# Altium schematic sheet ALLPRINT-CAPBOARD-677512-INDEX-INPUTS.SchDoc
size A3; Organization: Altium Limited; Address1: 3 Minna Close; Address2: Belrose; Address3: NSW 2085; Address4: Australia; DocumentNumber: 4; SheetNumber: 3; SheetTotal: 11
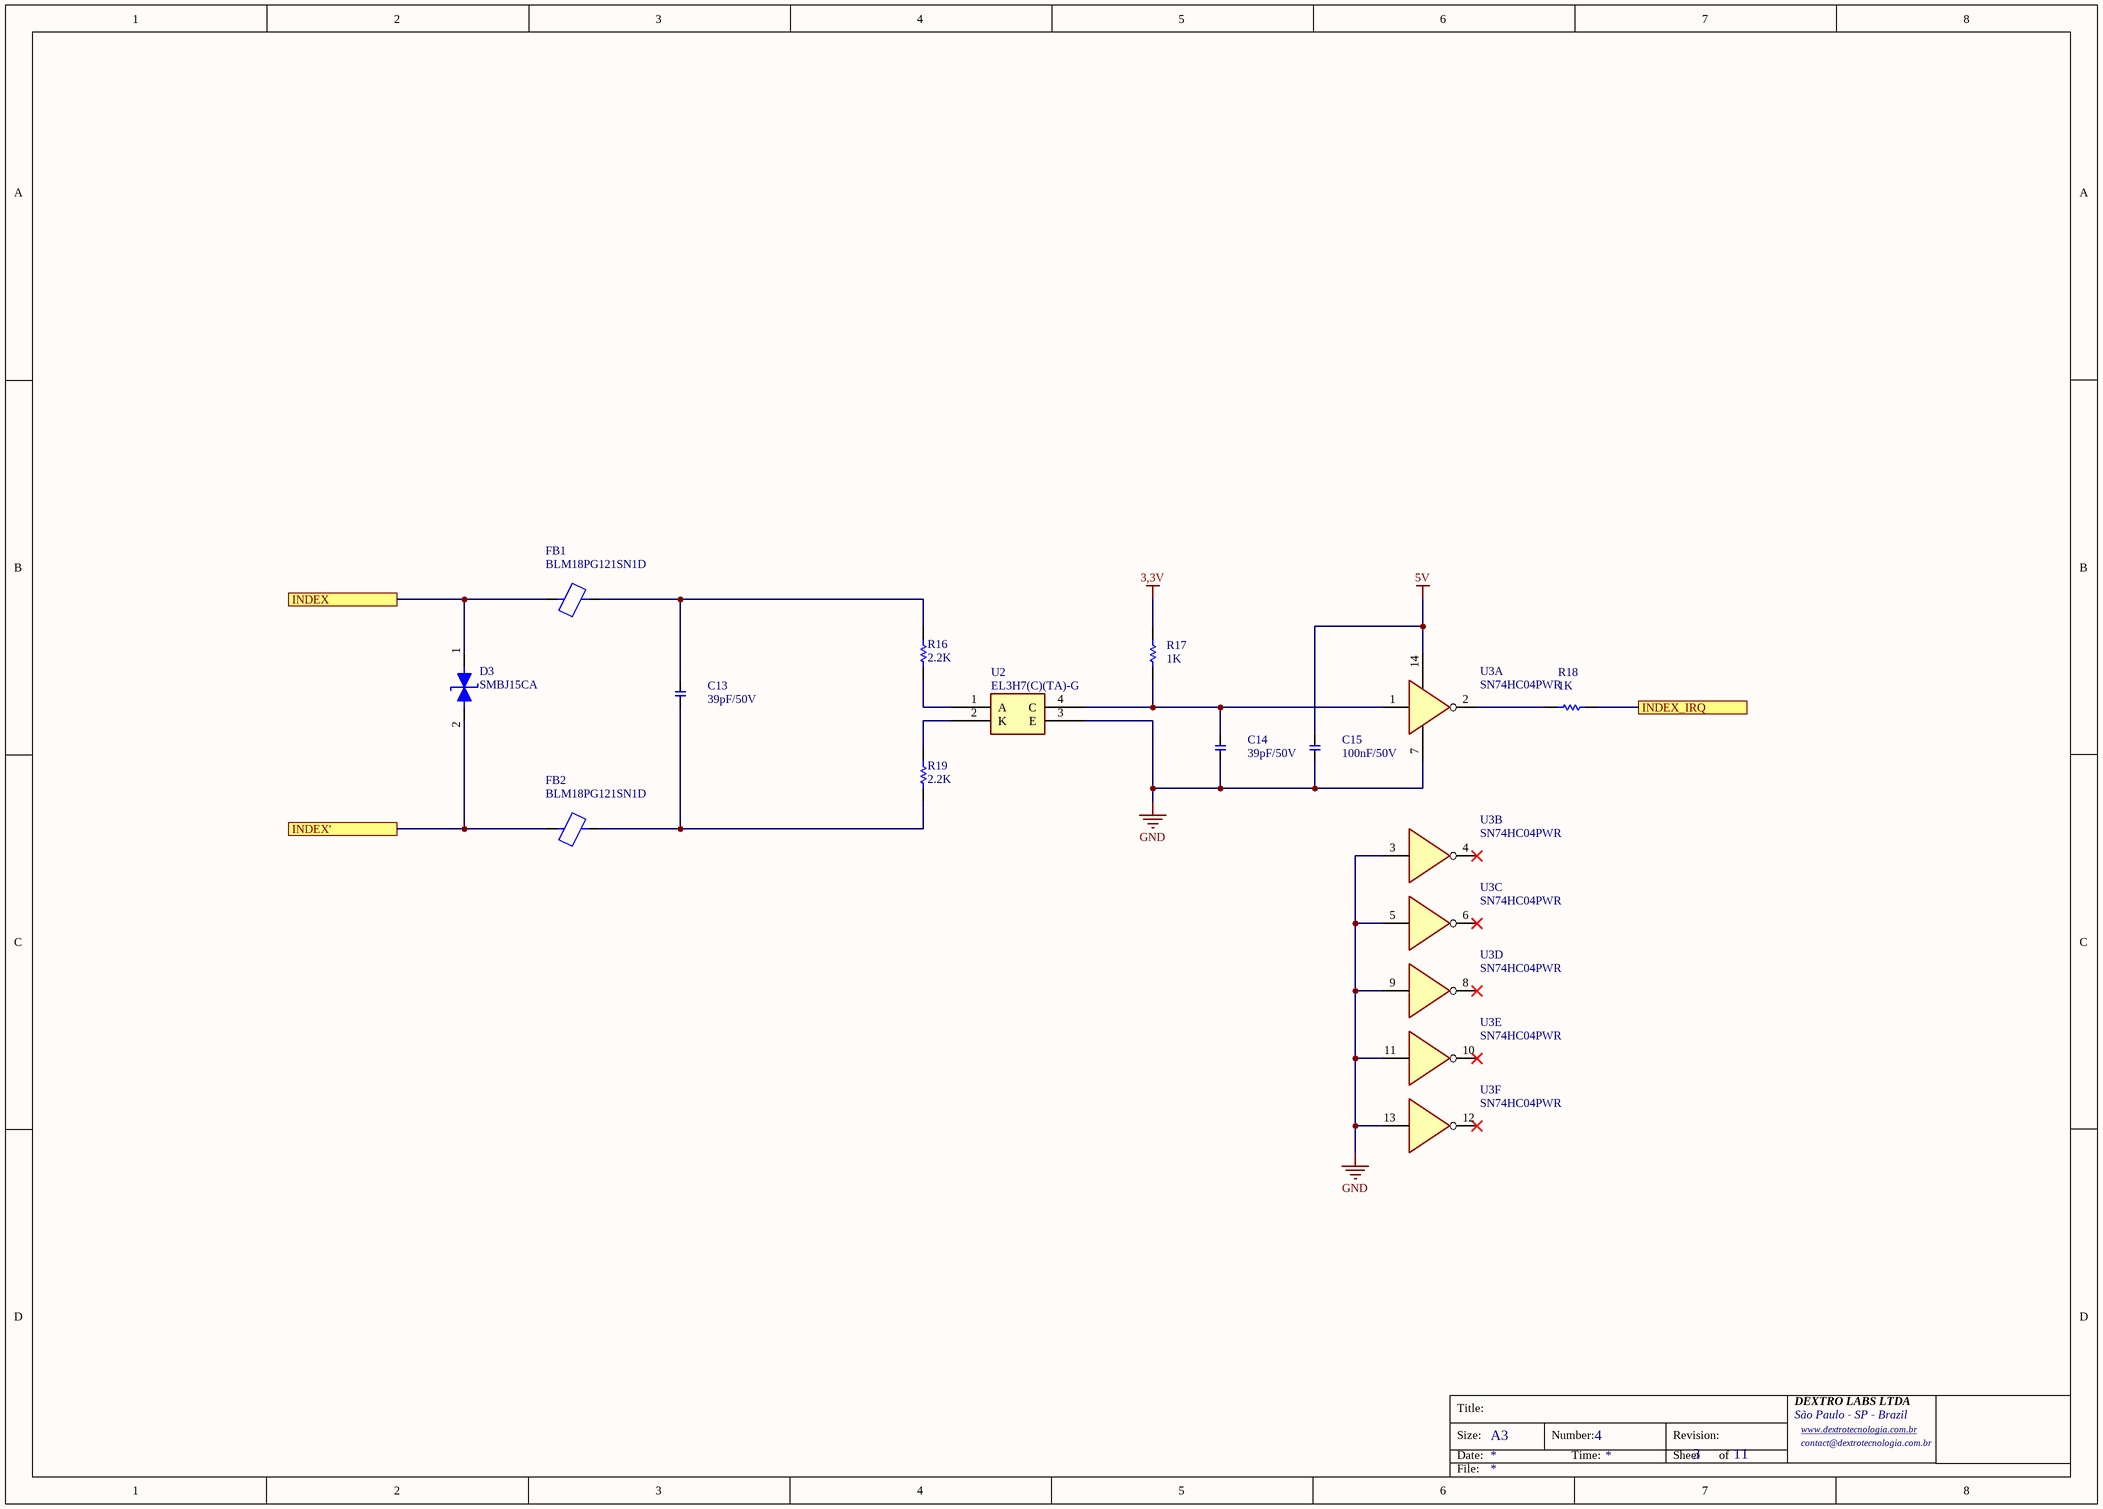
[diagram p0: ALLPRINT-CAPBOARD-677512-INDEX-INPUTS.SchDoc]

## Parts
C13  39pF/50V  [CAP-0603]
C14  39pF/50V  [CAP-0603]
C15  100nF/50V  [CAP-0603]
D3  SMBJ15CA  [DO214-AA]
FB1  BLM18PG121SN1D  [RES-0603]
FB2  BLM18PG121SN1D  [RES-0603]
R16  2.2K  [RES-0805]
R17  1K  [RES-0805]
R18  1K  [RES-0805]
R19  2.2K  [RES-0805]
U2  EL3H7(C)(TA)-G  [SSOP-4]
U3  SN74HC04PWR  [TSSOP-14]  (parts A,B,C,D,E,F of 6)

## Ports
INDEX (see ALLPRINT-CAPBOARD-677512-GENERAL[4A]), INDEX' (see ALLPRINT-CAPBOARD-677512-GENERAL[4A]), INDEX_IRQ (see ALLPRINT-CAPBOARD-677512-GENERAL[3A], ALLPRINT-CAPBOARD-677512-MCU[5B])

## Nets
3,3V: R17.2
5V: C15.2 U3.14(VCC)
GND: C14.1 C15.1 U2.3(E) U3.3(4A) U3.5 U3.7(GND) U3.9 U3.11 U3.13
INDEX: D3.1(A1) FB1.1 ; port INDEX
INDEX': D3.2(A2) FB2.1 ; port INDEX'
INDEX_IRQ: R18.2 ; port INDEX_IRQ
NetC13_1: C13.1 FB2.2 R19.1
NetC13_2: C13.2 FB1.2 R16.2
NetC14_2: C14.2 R17.1 U2.4(C) U3.1(1A)
NetR16_1: R16.1 U2.1(A)
NetR18_1: R18.1 U3.2
NetR19_2: R19.2 U2.2(K)

Not connected (* = marked no-connect by the designer): U3 4(4Y)* 6* 8* 10* 12*

## Notes on the sheet
- Title:
- Size:
- Date:
- A3
- Number:
- Time:
- Revision:
- Sheet
- of
- DEXTRO LABS LTDA
- São Paulo - SP - Brazil
- www.dextrotecnologia.com.br <http://www.dextrotecnologia.com.br>
- contact@dextrotecnologia.com.br
- File:

## Library data of the parts
C13 C14 = CAP-39pF/50V-0603-X7R-MLCC: 50V 39pF X7R ±10% 0603 Multilayer Ceramic Capacitors MLCC - SMD/SMT ROHS; LCSC: C107049
C15 = CAP-100nF/50V-0603-X7R-MLCC: 50V 100nF X7R ±10% 0603 Multilayer Ceramic Capacitors MLCC - SMD/SMT ROHS; LCSC: C14663
D3 = SMBJ15CA: 24.6A 600W@8/20us 24.4V 19.2V Bidirectional 15V SMB(DO-214AA) ESD and Surge Protection (TVS/ESD) ROHS; LCSC: C2760879
FB1 FB2 = BLM18PG121SN1D: FERRITE BEAD 120Ω 0603 1LN; LCSC: C14709
R16 R19 = RES-2.2K-1%-125mW-0805: 125mW 2.2kΩ 150V ±100ppm/℃ Thick Film Resistor ±1% 0805 Chip Resistor - Surface Mount ROHS; LCSC: C2907234
R17 R18 = RES-1K-1%-125mW-0805: 125mW Thick Film Resistor 150V ±100ppm/℃ ±1% 1kΩ 0805 Chip Resistor - Surface Mount ROHS; LCSC: C17513
U2 = EL3H7(C)(TA)-G: 80V 3.75kV 50mA 200mV@10mA,1mA 6V 1.2V DC SSOP-4-1.27mm Transistor, Photovoltaic Output Optoisolators ROHS; LCSC: C92243
U3 = SN74HC04PWR: 2V~6V 16ns@6V,50pF 2uA 6 1 TSSOP-14 Gates and Inverters RoHS; LCSC: C6810